# Altium schematic sheet Main-transformer.SchDoc
size A4; SheetNumber: 3; SheetTotal: 5
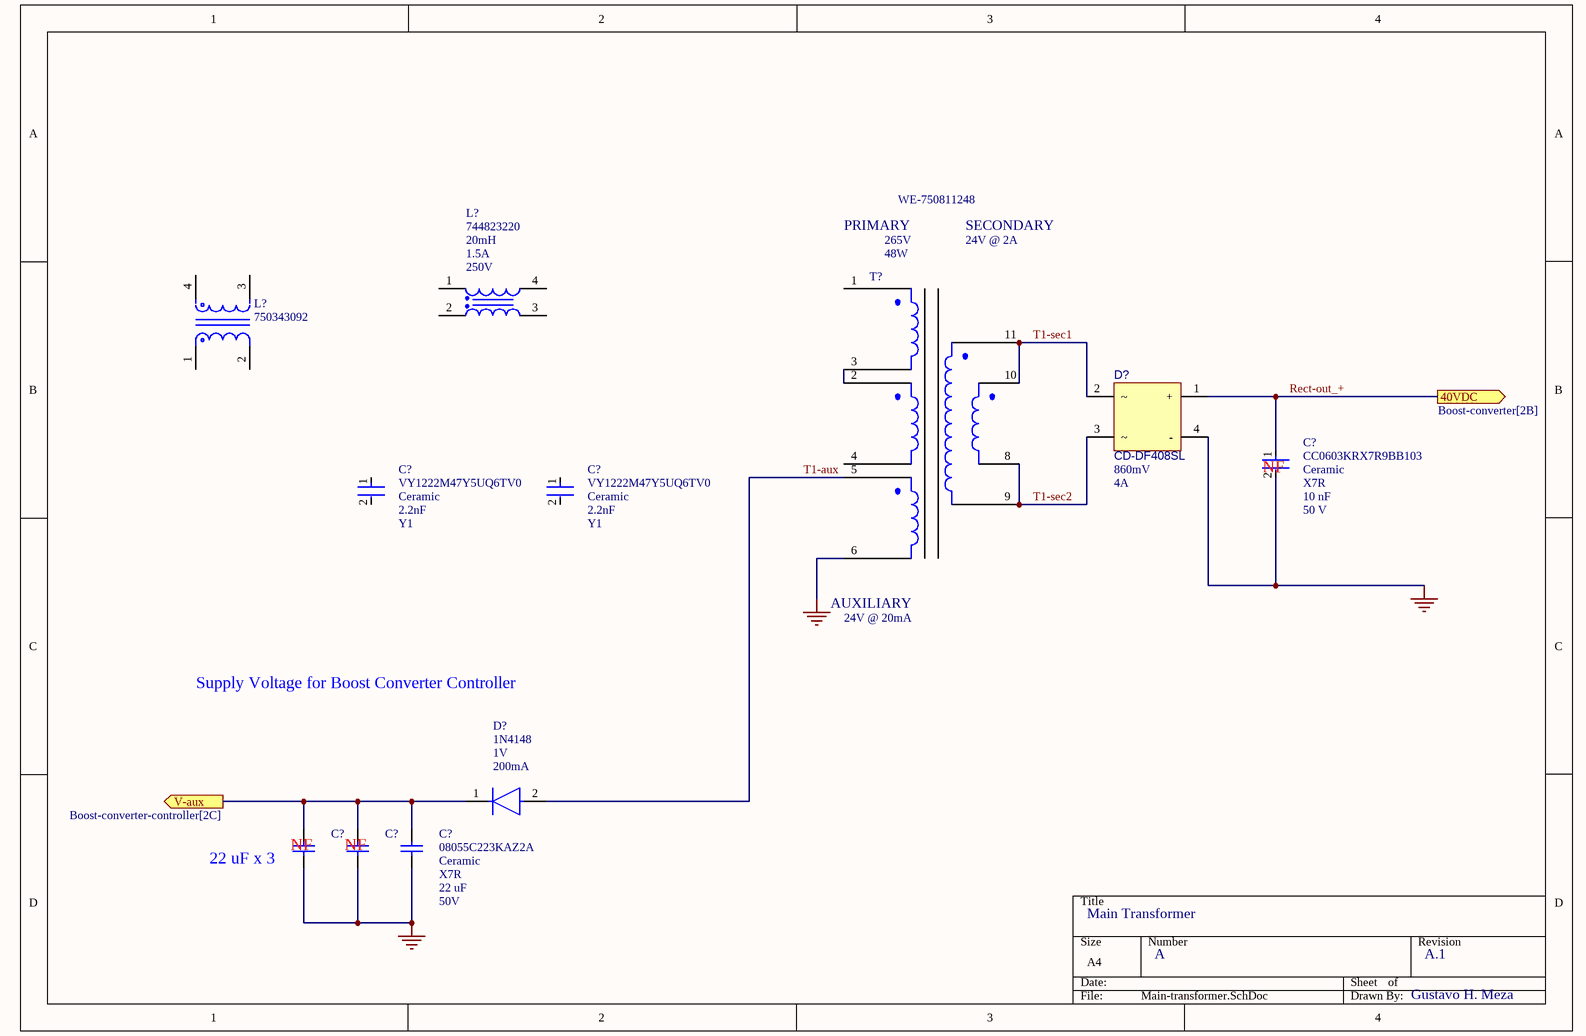
[diagram p0: Main-transformer.SchDoc]

## Parts
(Parts that share a designator on the sheet are numbered #1, #2 ... from top to bottom, then left to right.)
C?#1  CC0603KRX7R9BB103  Temperature Characteristic: X7R  Voltage Rating: 50 V  Material: Ceramic  Capacitance: 10 nF  [FP-CC0603-DA-MFG]
C?#2  VY1222M47Y5UQ6TV0  Resistor Type: Ceramic  Capacitance: 2.2nF  Safety rating: Y1  [FP-VY1470-MFG]
C?#3  VY1222M47Y5UQ6TV0  Resistor Type: Ceramic  Capacitance: 2.2nF  Safety rating: Y1  [FP-VY1470-MFG]
C?#4  08055C223KAZ2A  [CAPC2013X94X50ML20T25]  (value not drawn)
C?#5  08055C223KAZ2A  [CAPC2013X94X50ML20T25]  (value not drawn)
C?#6  08055C223KAZ2A  Capacitance: 22 uF  Voltage rating: 50V  Dieleectric: X7R  Material: Ceramic  [CAPC2013X94X50ML20T25]
D?#1  CD-DF408SL  Forward Voltage: 860mV  Forward Current: 4A  [CD-DF408SL-Footprint-1]
D?#2  1N4148  Forward Voltage: 1V  Output Current: 200mA  [FP-017AG-MFG]
L?#1  744823220  Voltage Rating: 250V  Current Rating: 1.5A  Inductance: 20mH  [WE-CMB_Type M_L23W13.8H25.5]
L?#2  750343092  [FP-750343092-0]
T?  WE-750811248  Power: 48W  Voltage Rating: 265V  Auxiliary winding voltage: 24V @ 20mA  Secondary winding voltage: 24V @ 2A  [WE-750811248-Footprint-1]

## Ports
40VDC (out, see Boost-converter[2B]), V-aux (out, see Boost-converter-controller[2C])

## Nets
GND: C?#1.2 C?#4.1 C?#5.1 C?#6.1 D?#1.4(-) T?.6
Rect-out_+: C?#1.1 D?#1.1(+) ; port 40VDC
T1-aux: D?#2.2(A) T?.5
T1-sec1: D?#1.2 T?.10 T?.11
T1-sec2: D?#1.3 T?.8 T?.9
V-aux: C?#4.2 C?#5.2 C?#6.2 D?#2.1(C) ; port V-aux
NetT?_2: T?.2 T?.3

Not connected (* = marked no-connect by the designer): C?#2 1 2; C?#3 1 2; L?#1 1 2 3 4; L?#2 1 2 3 4; T? 1 4

## Notes on the sheet
- PRIMARY
- SECONDARY
- (near C?#1) NF
- (near T?) AUXILIARY
- Supply Voltage for Boost Converter Controller
- (near C?#4) NF
- (near C?#5) NF
- (near C?#4) 22 uF x 3
- Main Transformer
- A
- A.1
- Gustavo H. Meza

## Library data of the parts
C?#1 = CMP-2100-03600-2: CAP CER 10000PF 50V X7R 0603; Manufacturer: YAGEO; Tolerance: 0.1; Temperature Coefficient: 15%; Description: CC0603 10 nF X7R 10.00% 50 V; Value: 10 nF; Mouser Description: Multilayer Ceramic Capacitor, CC Series, 0.01 - F, - 10%, X7R, 50 V, 0603 [1608 Metric]; Digikey Description: CAP CER 10000PF 50V X7R 0603; Height: 0.9mm; Category: Cap; Footprint Url: http://www.yageo.com/exep/pages/download/literatures/UPY-C_GEN_24.pdf; Lead Free: Yes; Manufacturer Part Number: CC0603KRX7R9BB103; Temperature: -55°C to +125°C; Device Class L3: Ceramic Capacitors; ComponentLink2Description: Datasheet; Voltage: 50 V; Package: CC0603-DA; Octopart: https://octopart.com/cc0603krx7r9bb103-yageo-192938; Automotive: No; Temperature Range High: +125°C; Temperature Range Low: -55°C; RoHS: TRUE; Device Class L1: Passive Components; ComponentLink2URL: http://www.yageo.com/documents/recent/UPY-GPHC_X7R_6.3V-to-50V_18.pdf; Device Class L2: Capacitors
C?#2 C?#3 = CMP-02417-000069-1: CAP CER 2200PF 760VAC Y5U RADIAL; Lead Diameter: 0.6mm; Ratings: X1; Voltage Rating (AC): 500V; Lead/Base Style: Kinked; Tolerance: 20%; Max Operating Temperature: 125°C; Contact Plating: Tin; Thickness: 5mm; Width: 5mm; Min Operating Temperature: -40°C; Depth: 5mm; Mount: Through Hole; Termination: Radial; Lead Free: Lead Free; Diameter: 12mm; Height: 15mm; Radiation Hardening: No; Lead Pitch: 10mm; Case/Package: Radial; RoHS Compliant: Yes; Series: VY1; Dielectric: Y5U; Construction: RADIAL; Voltage: 500V; Voltage Rating (DC): 500V; Packaging: Tape and Reel; Height - Seated (Max): 0.63inch; Package Quantity: 500
C?#4-C?#6 = CMP-2007-04398-1: Manufacturer: AVX Interconnect / Elco; Part Number: 08055C223KAZ2A
D?#1 = CMP-004-00034-1: Bridge Rectifier Diode, 1 Phase, 4A, 800V V(RRM), Silicon; Max Surge Current: 150A; Reach SVHC Compliant: No; Min Operating Temperature: -55°C; Max Operating Temperature: 175°C; RoHS Compliant: Yes; Mounting Technology: Flat; JESD-609 Code: e3; Diode Type: RECTIFIER
D?#2 = CMP-07163-000046-1: DIODE GEN PURP 100V 200MA DO35; Max Power Dissipation: 500mW; Max Reverse Current: 5uA; Forward Current: 300mA; Current: 4A; Reverse Recovery Time: 4ns; Element Configuration: Single; Outside Diameter: 1.85mm; Capacitance: 4pF; Polarity: Standard; Max Forward Surge Current (Ifsm): 1A; Reverse Voltage: 100V; Average Rectified Current: 200mA; Diameter: 1.91mm; Max Repetitive Reverse Voltage (Vrrm): 100V; Current Rating: 200mA; Case/Package: DO-35; Lead Free: Lead Free; Number of Pins: 2; Recovery Time: 4ns; Packaging: Bulk; Contact Plating: Tin; Voltage: 100V; Mount: Through Hole; Max Surge Current: 4A; Package Quantity: 2000; Width: 1.91mm; Max Reverse Voltage (DC): 100V; Length: 4.56mm; Radiation Hardening: No; Power Dissipation: 500mW; Voltage Rating (DC): 100V; Peak Non-Repetitive Surge Current: 4A; REACH SVHC: No SVHC; Height: 4.56mm; Max Operating Temperature: 175°C; Series: -; Weight: 0.01lb; Min Operating Temperature: -65°C
L?#1 = CMP-0223-00090-2: NexarPartId: 22862925; Pin Length: 3mm; Resistance: 270mΩ; Inductance Tolerance: 30%; Max Operating Temperature: 125°C; Length: 23mm; Ambient Temperature Range Low: -40°C; Number of Pins: 4; Ambient Temperature Range High: 70°C; Height: 25.5mm; Min Operating Temperature: -40°C; Width: 13.8mm; RoHS: Compliant; Packaging: Bulk
L?#2 = CMP-207849-000003-1: Power Common Mode Choke; RoHS Compliant: No
T? = CMP-012-00000-1: Power Transformers MID-L3798/99 Offline Isol 3.6uH +-10%; Inductance: 300uH; Turns Ratio: 0.167372; Min Operating Temperature: -40°C; Mounting Technology: THT; Max Operating Temperature: 125°C; Pins: 10; RoHS Compliant: Yes